# Altium project MainBoard.PrjPcb (part 2 of 3)

## Sheet HMI.SchDoc: Témoins et boutons
size Letter; Organization: Robocup Ulaval; DocumentNumber: 7; Revision: 1.0; SheetNumber: 7; SheetTotal: 10; Version: Gamma 1.0; Conceptor: Philippe T. Simon B. Léonard G. Alexia B-L.
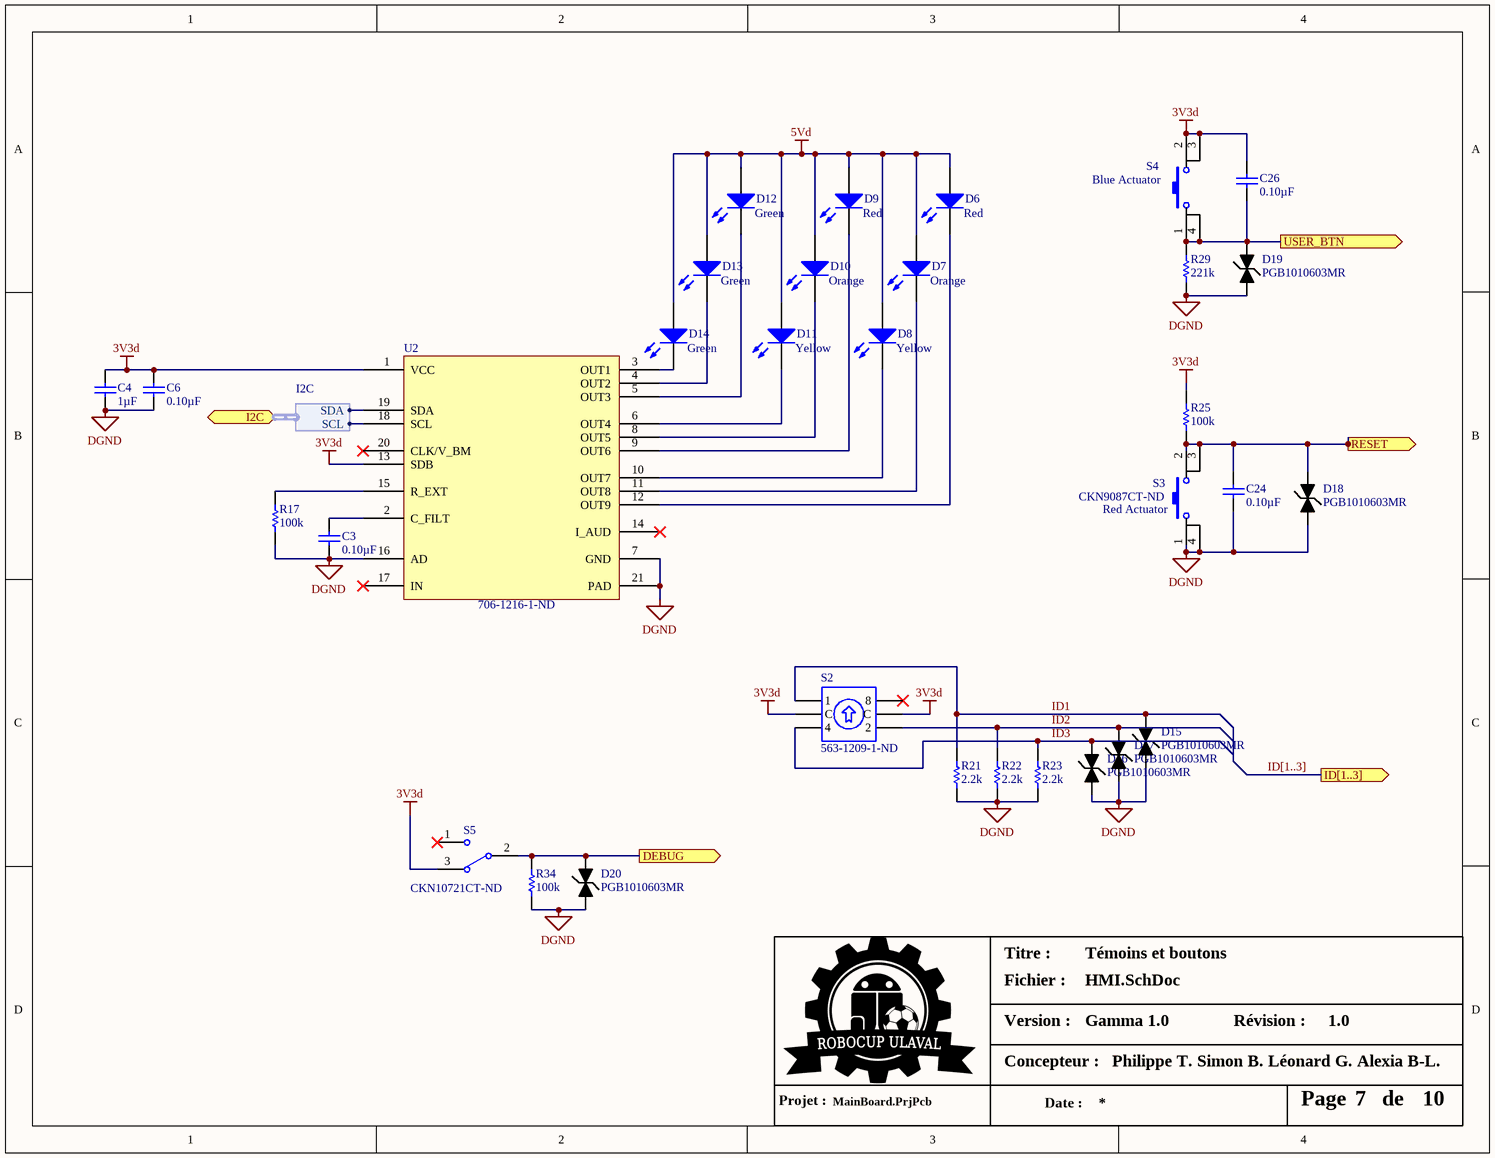
[diagram p5: HMI.SchDoc]

### Parts
C3  Capacitance: 0.10µF  [0603]  (hidden comment: CL10B104KB8SFNC)
C4  Capacitance: 1µF  [0805]  (hidden comment: CL21B105KBFNFNE)
C6  Capacitance: 0.10µF  [0603]  (hidden comment: CL10B104KB8SFNC)
C24  Capacitance: 0.10µF  [0603]  (hidden comment: CL10B104KB8SFNC)
C26  Capacitance: 0.10µF  [0603]  (hidden comment: CL10B104KB8SFNC)
D6  Color: Red  [0805]  (hidden comment: LH R974-LP-1)
D7  Color: Orange  [0805]  (hidden comment: AA1112H-TR)
D8  Color: Yellow  [0805]  (hidden comment: LY R976-PS-36)
D9  Color: Red  [0805]  (hidden comment: LH R974-LP-1)
D10  Color: Orange  [0805]  (hidden comment: AA1112H-TR)
D11  Color: Yellow  [0805]  (hidden comment: LY R976-PS-36)
D12  Color: Green  [0805]  (hidden comment: LG R971-KN-1)
D13  Color: Green  [0805]  (hidden comment: LG R971-KN-1)
D14  Color: Green  [0805]  (hidden comment: LG R971-KN-1)
D15  PGB1010603MR  [0603]
D16  PGB1010603MR  [0603]
D17  PGB1010603MR  [0603]
D18  PGB1010603MR  [0603]
D19  PGB1010603MR  [0603]
D20  PGB1010603MR  [0603]
R17  Resistance (Ohms): 100k  [0603]  (hidden comment: RC0603JR-07100KL)
R21  Resistance (Ohms): 2.2k  [0603]  (hidden comment: RC0603FR-072K2L)
R22  Resistance (Ohms): 2.2k  [0603]  (hidden comment: RC0603FR-072K2L)
R23  Resistance (Ohms): 2.2k  [0603]  (hidden comment: RC0603FR-072K2L)
R25  Resistance (Ohms): 100k  [0603]  (hidden comment: RC0603JR-07100KL)
R29  Resistance (Ohms): 221k  [0603]  (hidden comment: RC0603FR-07221KL)
R34  Resistance (Ohms): 100k  [0603]  (hidden comment: RC0603JR-07100KL)
S2  Supplier Part Number 1: 563-1209-1-ND  [RotarySwitch]  (hidden comment: SH-7010TB)
S3  Supplier Part Number 1: CKN9087CT-ND  Features: Red Actuator  [6 mm Tact Switches]  (hidden comment: PTS645SK50SMTR92 LFS)
S4  Features: Blue Actuator  [6 mm Tact Switches]  (hidden comment: PTS645SM43SMTR92 LFS)
S5  Supplier Part Number 1: CKN10721CT-ND  [SPDT-SW]  (hidden comment: JS102011JCQN)
U2  Supplier Part Number 1: 706-1216-1-ND  [QFN40P300X300X80_HS-21N]  (hidden comment: IS31FL3199-QFLS2-TR)

### Ports
DEBUG (out), I2C (harness I2C), ID[1..3] (out), RESET (out), USER_BTN (out)

### Harnesses
I2C: SCL, SDA

### Nets
3V3d: C4.2 C6.2 C26.2 R25.2 S2.2(C) S2.5(C) S4.2 S4.3 S5.3 U2.1(VCC) U2.13(SDB)
5Vd: D6.1(A) D7.1(A) D8.1(A) D9.1(A) D10.1(A) D11.1(A) D12.1(A) D13.1(A) D14.1(A)
DGND: C3.1 C4.1 C6.1 C24.1 D15.1 D16.1 D17.1 D18.1 D19.1 D20.1 R17.1 R21.1 R22.1 R23.1 R29.1 R34.1 S3.1 S3.4 U2.7(GND) U2.16(AD) U2.21(PAD)
DEBUG: D20.2 R34.2 S5.2 ; port DEBUG
ID1: D15.2 R21.2 S2.1
ID2: D17.2 R22.2 S2.4(2)
ID3: D16.2 R23.2 S2.3(4)
RESET: C24.2 D18.2 R25.1 S3.2 S3.3 ; port RESET
SCL: U2.18(SCL) ; port I2C.SCL
SDA: U2.19(SDA) ; port I2C.SDA
USER_BTN: C26.1 D19.2 R29.2 S4.1 S4.4 ; port USER_BTN
NetC3_2: C3.2 U2.2(C_FILT)
NetD6_2: D6.2(K) U2.12(OUT9)
NetD7_2: D7.2(K) U2.11(OUT8)
NetD8_2: D8.2(K) U2.10(OUT7)
NetD9_2: D9.2(K) U2.9(OUT6)
NetD10_2: D10.2(K) U2.8(OUT5)
NetD11_2: D11.2(K) U2.6(OUT4)
NetD12_2: D12.2(K) U2.5(OUT3)
NetD13_2: D13.2(K) U2.4(OUT2)
NetD14_2: D14.2(K) U2.3(OUT1)
NetR17_2: R17.2 U2.15(R_EXT)

Not connected (* = marked no-connect by the designer): S2 6(8)*; S5 1*; U2 14(I_AUD)* 17(IN)* 20(CLK/V_BM)*

### Buses and harness runs
bus ID[1..3] = port ID[1..3]

### Notes on the sheet
- Titre :
- Version :
- Fichier :
- Révision :
- Projet :
- Concepteur :
- Date :
- Page
- de

### Library data of the parts
C3 C6 C24 C26 = CL10B104KB8SFNC: CAP CER 0.1UF 50V X7R 0603; Manufacturer: Samsung Electro-Mechanics America, Inc.; Tolerance: ±10%; Supplier 1: Digi-Key; Manufacturer Part Number: CL10B104KB8SFNC; RoHS: RoHS Compliant; Category: Capacitors; Packaging: Cut Tape (CT); Voltage - Rated: 50V; Temperature Coefficient: X7R; Mounting Type: Surface Mount, MLCC; Operating Temperature: -55°C ~ 125°C; Applications: Boardflex Sensitive; Ratings: -; Package / Case: 0603 (1608 Metric); Size / Dimension: 0.063" L x 0.031" W (1.60mm x 0.80mm); Height - Seated (Max): -; Thickness (Max): 0.035" (0.90mm); Lead Spacing: -; Features: Soft Termination; Lead Style: -; ComponentLink1URL: http://www.samsungsem.com/kr/support/product-search/mlcc/CL10B104KB8SFNC.jsp; ComponentLink1Description: http://www.samsungsem.com/kr/support/product-search/mlcc/CL10B104KB8SFNC.jsp; Supplier Part Number 1: 445-173846-1-ND
C4 = CL21B105KBFNFNE: CAP CER 1UF 50V X7R 0805; Manufacturer: Samsung Electro-Mechanics America, Inc.; Tolerance: ±10%; Supplier 1: Digi-Key; Manufacturer Part Number: CL21B105KBFNFNE; RoHS: RoHS Compliant; Stock 1: 21699; Pricing 1: 1=0.27, 10=0.186, 25=0.14, 50=0.1072, 100=0.0884, 500=0.06238, 1000=0.05123 (CAD); Packaging: Cut Tape (CT); Voltage - Rated: 50V; Temperature Coefficient: X7R; Mounting Type: Surface Mount, MLCC; Operating Temperature: -55°C ~ 125°C; Applications: General Purpose; Ratings: -; Package / Case: 0805 (2012 Metric); Size / Dimension: 0.079" L x 0.049" W (2.00mm x 1.25mm); Height - Seated (Max): -; Thickness (Max): 0.053" (1.35mm); Lead Spacing: -; Features: -; Lead Style: -; ComponentLink1URL: http://www.samsungsem.com/kr/support/product-search/mlcc/CL21B105KBFNFNE.jsp; ComponentLink1Description: http://www.samsungsem.com/kr/support/product-search/mlcc/CL21B105KBFNFNE.jsp; Supplier Part Number 1: 1276-2928-1-ND; Category: Capacitors
D6 D9 = LH R974-LP-1: LED RED DIFFUSED 0805 SMD; Manufacturer: OSRAM Opto Semiconductors Inc.; Lens Color: White; Millicandela Rating: 41mcd; Lens Style/Size: Rectangle with Flat Top, 1.30mm x 1.25mm; Voltage - Forward (Vf) (Typ): 1.8V; Current - Test: 20mA; Viewing Angle: 160°; Wavelength - Dominant: 645nm; Wavelength - Peak: 660nm; Supplier 1: Digi-Key; Manufacturer Part Number: LH R974-LP-1; RoHS: RoHS Compliant; Category: Optoelectronics; Stock 1: 124060; Pricing 1: 1=0.37, 10=0.267, 25=0.1972, 100=0.141, 250=0.09588, 500=0.0846, 1000=0.06626 (CAD); Packaging: Cut Tape (CT); Lens Transparency: Diffused; Mounting Type: Surface Mount; Features: -; Package / Case: 0805 (2012 Metric); Supplier Device Package: *; Size / Dimension: 2.00mm L x 1.25mm W; Height (Max): 0.90mm; ComponentLink1URL: http://www.osram-os.com/Graphics/XPic8/00078869_0.pdf; ComponentLink1Description: http://www.osram-os.com/Graphics/XPic8/00078869_0.pdf; Supplier Part Number 1: 475-1415-1-ND
D7 D10 = AA1112H-TR: LED ORANGE DIFFUSED 0805 SMD; Manufacturer: Stanley Electric Co; Lens Color: White; Millicandela Rating: 3.7mcd; Lens Style/Size: Rectangle with Flat Top, 1.20mm x 1.25mm; Voltage - Forward (Vf) (Typ): 2.2V; Current - Test: 20mA; Viewing Angle: 153°, 154°; Wavelength - Dominant: 606nm; Wavelength - Peak: 605nm; Supplier 1: Digi-Key; Manufacturer Part Number: AA1112H-TR; RoHS: RoHS Compliant; Category: Optoelectronics; Stock 1: 7828; Pricing 1: 1=0.65, 10=0.458, 25=0.3752, 100=0.3003, 250=0.2252, 1000=0.16379 (CAD); Packaging: Cut Tape (CT); Lens Transparency: Diffused; Mounting Type: Surface Mount; Features: -; Package / Case: 0805 (2012 Metric); Supplier Device Package: 2125; Size / Dimension: 2.00mm L x 1.25mm W; Height (Max): 0.90mm; ComponentLink1URL: http://media.digikey.com/pdf/Data%20Sheets/Stanley%20Electric%20PDFs/BR1112H.pdf; ComponentLink1Description: http://media.digikey.com/pdf/Data%20Sheets/Stanley%20Electric%20PDFs/BR1112H.pdf; Supplier Part Number 1: 404-1018-1-ND
D8 D11 = LY R976-PS-36: LED YELLOW DIFFUSED 0805 SMD; Manufacturer: OSRAM Opto Semiconductors Inc.; Lens Color: White; Millicandela Rating: 162.5mcd; Lens Style/Size: Rectangle with Flat Top, 1.30mm x 1.25mm; Voltage - Forward (Vf) (Typ): 2V; Current - Test: 20mA; Viewing Angle: 160°; Wavelength - Dominant: 588nm; Wavelength - Peak: 591nm; Supplier 1: Digi-Key; Manufacturer Part Number: LY R976-PS-36; RoHS: RoHS Compliant; Category: Optoelectronics; Stock 1: 102790; Pricing 1: 1=0.38, 10=0.282, 25=0.2076, 100=0.1484, 250=0.10088, 500=0.08904, 1000=0.06974 (CAD); Packaging: Cut Tape (CT); Lens Transparency: Diffused; Mounting Type: Surface Mount; Features: -; Package / Case: 0805 (2012 Metric); Supplier Device Package: 0805; Size / Dimension: 2.00mm L x 1.25mm W; Height (Max): 0.90mm; ComponentLink1URL: http://www.osram-os.com/Graphics/XPic9/00078941_0.pdf; ComponentLink1Description: http://www.osram-os.com/Graphics/XPic9/00078941_0.pdf; Supplier Part Number 1: 475-2560-1-ND
D12-D14 = LG R971-KN-1: LED GREEN DIFFUSED 0805 SMD; Manufacturer: OSRAM Opto Semiconductors Inc.; Lens Color: White; Millicandela Rating: 26.05mcd; Lens Style/Size: Rectangle with Flat Top, 1.30mm x 1.25mm; Voltage - Forward (Vf) (Typ): 2.2V; Current - Test: 20mA; Viewing Angle: 160°; Wavelength - Dominant: 570nm; Wavelength - Peak: 572nm; Supplier 1: Digi-Key; Manufacturer Part Number: LG R971-KN-1; RoHS: RoHS Compliant; Category: Optoelectronics; Stock 1: 315869; Pricing 1: 1=0.37, 10=0.267, 25=0.1972, 100=0.141, 250=0.09588, 500=0.0846, 1000=0.06626 (CAD); Packaging: Cut Tape (CT); Lens Transparency: Diffused; Mounting Type: Surface Mount; Features: -; Package / Case: 0805 (2012 Metric); Supplier Device Package: *; Size / Dimension: 2.00mm L x 1.25mm W; Height (Max): 0.90mm; ComponentLink1URL: http://www.osram-os.com/Graphics/XPic9/00078860_0.pdf; ComponentLink1Description: http://www.osram-os.com/Graphics/XPic9/00078860_0.pdf; Supplier Part Number 1: 475-1410-1-ND
D15-D20 = PGB1010603MR: TVS DIODE 24VWM 150VC 0603; Supplier 1: Digi-Key; Supplier Part Number 1: F2594TR-ND
R17 R25 R34 = RC0603JR-07100KL: RES SMD 100K OHM 5% 1/10W 0603; Manufacturer: Yageo; Power (Watts): 0.1W, 1/10W; Temperature Coefficient: ±100ppm/°C; Supplier 1: Digi-Key; Manufacturer Part Number: RC0603JR-07100KL; RoHS: RoHS Compliant; Category: Resistors; Stock 1: 2803334; Pricing 1: 1=0.15, 10=0.017, 25=0.012, 100=0.0067, 250=0.00508, 500=0.00408, 1000=0.003, 2500=0.0026 (CAD); Packaging: Cut Tape (CT); Tolerance: ±5%; Composition: Thick Film; Features: Moisture Resistant; Operating Temperature: -55°C ~ 155°C; Package / Case: 0603 (1608 Metric); Supplier Device Package: 0603; Size / Dimension: 0.063" L x 0.031" W (1.60mm x 0.80mm); Height: 0.022" (0.55mm); Number of Terminations: 2; ComponentLink1URL: http://www.yageo.com/documents/recent/PYu-RC_Group_51_RoHS_L_04.pdf; ComponentLink1Description: http://www.yageo.com/documents/recent/PYu-RC_Group_51_RoHS_L_04.pdf; Supplier Part Number 1: 311-100KGRCT-ND
R21-R23 = RC0603FR-072K2L: RES SMD 2.2K OHM 1% 1/10W 0603; Manufacturer: Yageo; Power (Watts): 0.1W, 1/10W; Temperature Coefficient: ±100ppm/°C; Supplier 1: Digi-Key; Manufacturer Part Number: RC0603FR-072K2L; RoHS: RoHS Compliant; Category: Resistors; Stock 1: 297758; Pricing 1: 1=0.15, 10=0.021, 25=0.0152, 100=0.0086, 250=0.0066, 500=0.00526, 1000=0.00389, 2500=0.00337 (CAD); Packaging: Cut Tape (CT); Tolerance: ±1%; Composition: Thick Film; Features: Moisture Resistant; Operating Temperature: -55°C ~ 155°C; Package / Case: 0603 (1608 Metric); Supplier Device Package: 0603; Size / Dimension: 0.063" L x 0.031" W (1.60mm x 0.80mm); Height: 0.022" (0.55mm); Number of Terminations: 2; ComponentLink1URL: http://www.yageo.com/documents/recent/PYu-RC_Group_51_RoHS_L_04.pdf; ComponentLink1Description: http://www.yageo.com/documents/recent/PYu-RC_Group_51_RoHS_L_04.pdf; Supplier Part Number 1: 311-2.20KHRCT-ND
R29 = RC0603FR-07221KL: RES SMD 221K OHM 1% 1/10W 0603; Manufacturer: Yageo; Power (Watts): 0.1W, 1/10W; Temperature Coefficient: ±100ppm/°C; Supplier 1: Digi-Key; Manufacturer Part Number: RC0603FR-07221KL; RoHS: RoHS Compliant; Category: Resistors; Stock 1: 288409; Pricing 1: 1=0.15, 10=0.021, 25=0.0152, 100=0.0086, 250=0.0066, 500=0.00526, 1000=0.00389, 2500=0.00337 (CAD); Packaging: Cut Tape (CT); Tolerance: ±1%; Composition: Thick Film; Features: Moisture Resistant; Operating Temperature: -55°C ~ 155°C; Package / Case: 0603 (1608 Metric); Supplier Device Package: 0603; Size / Dimension: 0.063" L x 0.031" W (1.60mm x 0.80mm); Height: 0.022" (0.55mm); Number of Terminations: 2; ComponentLink1URL: http://www.yageo.com/documents/recent/PYu-RC_Group_51_RoHS_L_04.pdf; ComponentLink1Description: http://www.yageo.com/documents/recent/PYu-RC_Group_51_RoHS_L_04.pdf; Supplier Part Number 1: 311-221KHRCT-ND
S2 = SH-7010TB: SWITCH ROTARY DIP BCD 100MA 5V; Manufacturer: Copal Electronics Inc.; Number of Positions: 10; Voltage Rating: 5VDC; Actuator Type: Rotary for Tool; Actuator Level: Flush, Recessed; Pitch: 0.100" (2.54mm), Full; Washable: Yes; Body Material: Polyphenylene Sulfide (PPS); Electrical Life: 10,000 Steps; Supplier 1: Digi-Key; Manufacturer Part Number: SH-7010TB; RoHS: RoHS Compliant; Category: Switches; Stock 1: 18527; Pricing 1: 1=2.91, 10=2.798, 25=2.554, 50=2.4326, 100=2.1893, 250=2.00688 (CAD); Packaging: Cut Tape (CT); Circuit: BCD; Current Rating: 100mA; Contact Material: Copper Alloy; Contact Finish: Gold; Height Above Board: 0.148" (3.75mm); Mounting Type: Surface Mount; Termination Style: Gull Wing; Features: -; Length: 0.287" (7.30mm); Operating Temperature: -40°C ~ 85°C; Mechanical Life: -; ComponentLink1URL: http://www.nidec-copal-electronics.com/e/catalog/switch/sh-7000.pdf; ComponentLink1Description: http://www.nidec-copal-electronics.com/e/catalog/switch/sh-7000.pdf
S3 = PTS645SK50SMTR92 LFS: SWITCH TACTILE SPST-NO 0.05A 12V; Manufacturer: C&K Components; Switch Function: Off-Mom; Contact Rating @ Voltage: 0.05A @ 12VDC; Actuator Type: Standard; Actuator Height off PCB, from Pins: 5.00mm; Actuator Orientation: Top Actuated; Outline: 6.00mm x 6.00mm; Illumination: Non-Illuminated; Operating Force: 260gf; Actuator Material: Polyamide (PA66), Nylon 6/6; Mechanical Life: 100,000 Cycles; Supplier 1: Digi-Key; Manufacturer Part Number: PTS645SK50SMTR92 LFS; RoHS: RoHS Compliant; Category: Switches; Stock 1: 73782; Pricing 1: 1=0.38, 10=0.362, 25=0.35, 50=0.3374, 100=0.3186, 250=0.29976, 500=0.2873 (CAD); Packaging: Cut Tape (CT); Circuit: SPST-NO; Mounting Type: Surface Mount; Termination Style: Gull Wing; Illumination Voltage (Nominal): -; Illumination Type, Color: -; Ingress Protection: -; Switch Travel: -; Operating Temperature: -20°C ~ 60°C; ComponentLink1URL: http://media.digikey.com/pdf/Data%20Sheets/C&K/PTS645_Series.pdf; ComponentLink1Description: http://media.digikey.com/pdf/Data%20Sheets/C&K/PTS645_Series.pdf
S4 = PTS645SM43SMTR92 LFS: SWITCH TACTILE SPST-NO 0.05A 12V; Manufacturer: C&K Components; Switch Function: Off-Mom; Contact Rating @ Voltage: 0.05A @ 12VDC; Actuator Type: Standard; Actuator Height off PCB, from Pins: 4.30mm; Actuator Orientation: Top Actuated; Outline: 6.00mm x 6.00mm; Illumination: Non-Illuminated; Operating Force: 160gf; Actuator Material: Polyamide (PA66), Nylon 6/6; Mechanical Life: 100,000 Cycles; Supplier 1: Digi-Key; Supplier Part Number 1: CKN9112CT-ND; Manufacturer Part Number: PTS645SM43SMTR92 LFS; RoHS: RoHS Compliant; Category: Switches; Stock 1: 189506; Pricing 1: 1=0.44, 10=0.425, 25=0.4108, 50=0.3958, 100=0.3737, 250=0.35176, 500=0.33708 (CAD); Packaging: Cut Tape (CT); Circuit: SPST-NO; Mounting Type: Surface Mount; Termination Style: Gull Wing; Illumination Voltage (Nominal): -; Illumination Type, Color: -; Ingress Protection: -; Switch Travel: -; Operating Temperature: -20°C ~ 60°C; ComponentLink1URL: http://media.digikey.com/pdf/Data%20Sheets/C&K/PTS645_Series.pdf; ComponentLink1Description: http://media.digikey.com/pdf/Data%20Sheets/C&K/PTS645_Series.pdf
S5 = JS102011JCQN: SWITCH SLIDE SPDT 300MA 6V; Manufacturer: C&K Components; Contact Timing: Not Specified; Switch Function: On-On; Current Rating: 300mA (DC); Actuator Type: Standard; Actuator Length: 2.00mm; Actuator Material: Polyamide (PA46), Nylon 4/6; Electrical Life: 5,000 Cycles; Supplier 1: Digi-Key; Manufacturer Part Number: JS102011JCQN; RoHS: RoHS Compliant; Category: Switches; Stock 1: 1803; Pricing 1: 1=0.9, 10=0.873, 25=0.8544, 50=0.7636, 100=0.7272, 250=0.70896, 500=0.59992 (CAD); Packaging: Cut Tape (CT); Part Status: Active; Circuit: SPDT; Voltage Rating - AC: -; Voltage Rating - DC: 6V; Contact Material: Copper Alloy; Contact Finish: Silver; Mounting Type: Surface Mount; Termination Style: J Lead; Features: -; Switch Travel: 2.00mm; Operating Temperature: -40°C ~ 85°C; Mechanical Life: -; Operating Force: -; ComponentLink1URL: http://www.ck-components.com/media/1422/js.pdf; ComponentLink1Description: http://www.ck-components.com/media/1422/js.pdf
U2 = IS31FL3199-QFLS2-TR: IC LED DRIVER LIN DIM 40MA 20QFN; Manufacturer: ISSI, Integrated Silicon Solution Inc; Internal Switch(s): Yes; Number of Outputs: 9; Voltage - Supply (Min): 2.7V; Voltage - Supply (Max): 5.5V; Dimming: PWM; Supplier 1: Digi-Key; Manufacturer Part Number: IS31FL3199-QFLS2-TR; RoHS: RoHS Compliant; Category: Integrated Circuits (ICs); Stock 1: 2174; Pricing 1: 1=2.4, 10=2.134, 25=1.9272, 100=1.6863, 250=1.4798, 500=1.30778, 1000=1.03244 (CAD); Packaging: Cut Tape (CT); Type: Linear; Topology: -; Voltage - Output: -; Current - Output / Channel: 40mA; Frequency: -; Applications: -; Operating Temperature: -40°C ~ 85°C (TA); Mounting Type: Surface Mount; Package / Case: 20-VFQFN Exposed Pad; Supplier Device Package: 20-QFN (3x3); ComponentLink1URL: http://www.issi.com/WW/pdf/31FL3199.pdf; ComponentLink1Description: http://www.issi.com/WW/pdf/31FL3199.pdf

## Sheet IMU.SchDoc: Capteur inertiel
size Letter; Organization: Robocup Ulaval; DocumentNumber: 6; Revision: 1.0; SheetNumber: 6; SheetTotal: 10; Version: Gamma 1.0; Conceptor: Philippe T. Simon B. Léonard G. Alexia B-L.
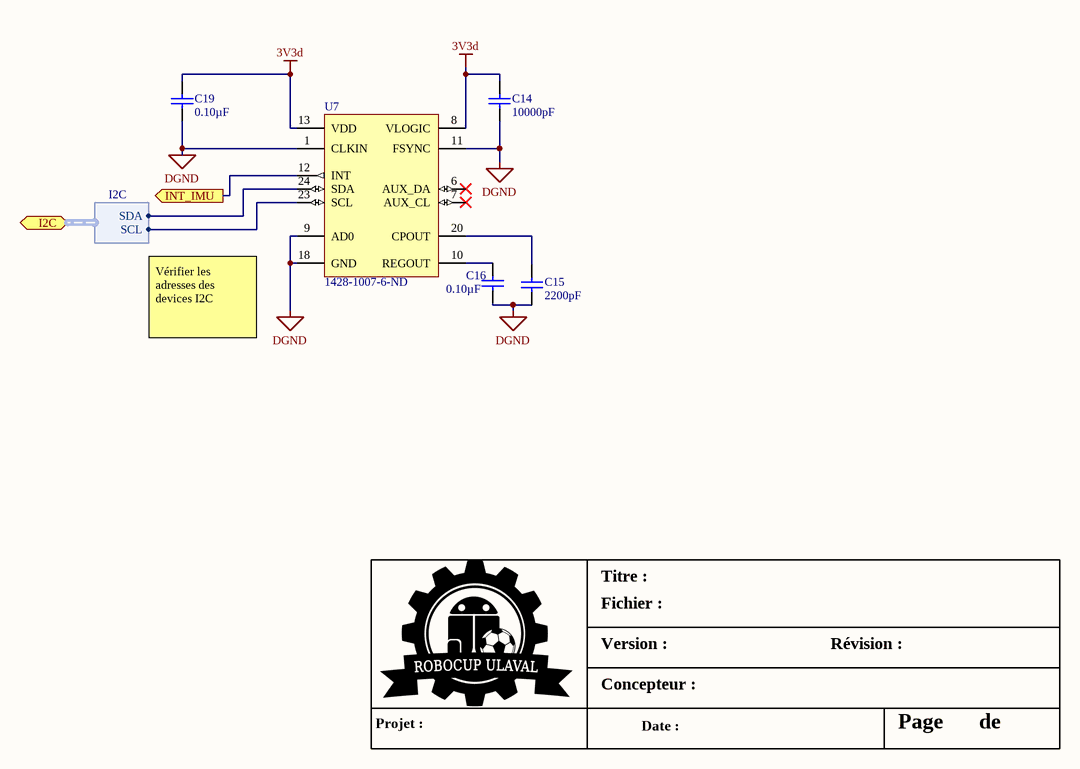
[diagram p6: IMU.SchDoc]

### Parts
C14  Capacitance: 10000pF  [0603]  (hidden comment: GRM188R71H103KA01D)
C15  Capacitance: 2200pF  [0603]  (hidden comment: CL10B222KB8SFNC)
C16  Capacitance: 0.10µF  [0603]  (hidden comment: CL10B104KB8SFNC)
C19  Capacitance: 0.10µF  [0603]  (hidden comment: CL10B104KB8SFNC)
U7  Supplier Part Number 1: 1428-1007-6-ND  [VQFN-24]  (hidden comment: MPU-6050)

### Ports
I2C (harness I2C), INT_IMU (out)

### Harnesses
I2C: SCL, SDA

### Nets
3V3d: C14.2 C19.2 U7.8(VLOGIC) U7.13(VDD)
DGND: C14.1 C15.1 C16.1 C19.1 U7.1(CLKIN) U7.9(AD0) U7.11(FSYNC) U7.18(GND)
IMU_IRQ: U7.12(INT) ; port INT_IMU
SCL: U7.23(SCL) ; port I2C.SCL
SDA: U7.24(SDA) ; port I2C.SDA
NetC15_2: C15.2 U7.20(CPOUT)
NetC16_2: C16.2 U7.10(REGOUT)

Not connected (* = marked no-connect by the designer): U7 6(AUX_DA)* 7(AUX_CL)*

### Notes on the sheet
- Vérifier les adresses des devices I2C
- Titre :
- Version :
- Fichier :
- Révision :
- Projet :
- Concepteur :
- Date :
- Page
- de

### Library data of the parts
C14 = GRM188R71H103KA01D: CAP CER 10000PF 50V X7R 0603; Manufacturer: Murata Electronics North America; Tolerance: ±10%; Supplier 1: Digi-Key; Manufacturer Part Number: GRM188R71H103KA01D; RoHS: RoHS Compliant; Category: Capacitors; Stock 1: 3064909; Pricing 1: 1=0.14, 10=0.027, 50=0.0142, 100=0.0121, 250=0.00988, 500=0.00848, 1000=0.00661 (CAD); Packaging: Cut Tape (CT); Voltage - Rated: 50V; Temperature Coefficient: X7R; Mounting Type: Surface Mount, MLCC; Operating Temperature: -55°C ~ 125°C; Applications: General Purpose; Ratings: -; Package / Case: 0603 (1608 Metric); Size / Dimension: 0.063" L x 0.031" W (1.60mm x 0.80mm); Height - Seated (Max): -; Thickness (Max): 0.035" (0.90mm); Lead Spacing: -; Features: -; Lead Style: -; ComponentLink1URL: http://www.murata.com/~/media/webrenewal/support/library/catalog/products/capacitor/mlcc/c02e.pdf; ComponentLink1Description: http://www.murata.com/~/media/webrenewal/support/library/catalog/products/capacitor/mlcc/c02e.pdf; Supplier Part Number 1: 490-1512-1-ND
C15 = CL10B222KB8SFNC: CAP CER 2200PF 50V X7R 0603; Manufacturer: Samsung Electro-Mechanics America, Inc.; Tolerance: ±10%; Supplier 1: Digi-Key; Manufacturer Part Number: CL10B222KB8SFNC; RoHS: RoHS Compliant; Category: Capacitors; Stock 1: 52876; Pricing 1: 1=0.14, 10=0.041, 25=0.0292, 50=0.0222, 100=0.0188, 500=0.01314, 1000=0.01024 (CAD); Packaging: Cut Tape (CT); Voltage - Rated: 50V; Temperature Coefficient: X7R; Mounting Type: Surface Mount, MLCC; Operating Temperature: -55°C ~ 125°C; Applications: Boardflex Sensitive; Ratings: -; Package / Case: 0603 (1608 Metric); Size / Dimension: 0.063" L x 0.031" W (1.60mm x 0.80mm); Height - Seated (Max): -; Thickness (Max): 0.035" (0.90mm); Lead Spacing: -; Features: Soft Termination; Lead Style: -; ComponentLink1URL: http://www.samsungsem.com/kr/support/product-search/mlcc/CL10B222KB8SFNC.jsp; ComponentLink1Description: http://www.samsungsem.com/kr/support/product-search/mlcc/CL10B222KB8SFNC.jsp; Supplier Part Number 1: 1276-1992-1-ND
C16 C19 = CL10B104KB8SFNC: as C3 on sheet HMI; Supplier 1: Digi-Key; Manufacturer Part Number: CL10B104KB8SFNC; RoHS: RoHS Compliant; Category: Capacitors; Packaging: Cut Tape (CT); Voltage - Rated: 50V; Temperature Coefficient: X7R; Mounting Type: Surface Mount, MLCC; Operating Temperature: -55°C ~ 125°C; Applications: Boardflex Sensitive; Ratings: -; Package / Case: 0603 (1608 Metric); Size / Dimension: 0.063" L x 0.031" W (1.60mm x 0.80mm); Height - Seated (Max): -; Thickness (Max): 0.035" (0.90mm); Lead Spacing: -; Features: Soft Termination; Lead Style: -; ComponentLink1URL: http://www.samsungsem.com/kr/support/product-search/mlcc/CL10B104KB8SFNC.jsp; ComponentLink1Description: http://www.samsungsem.com/kr/support/product-search/mlcc/CL10B104KB8SFNC.jsp; Supplier Part Number 1: 445-173846-1-ND
U7 = MPU-6050: GYRO/ACCELEROMETER 6AXIS 24QFN; Manufacturer: InvenSense; Sensor Type: Accelerometer, Gyroscope, 3 Axis; Output Type: I²C; Supplier 1: Digi-Key; Manufacturer Part Number: MPU-6050; RoHS: RoHS Compliant; Category: Sensors, Transducers; Stock 1: 15335; Pricing 1: 1=11.73, 5=10.282, 10=9.254, 25=8.2264, 50=7.6094, 100=6.5812, 500=6.1699, 1000=5.75857 (CAD); Operating Temperature: -40°C ~ 85°C (TA); ComponentLink1URL: http://store.invensense.com/datasheets/invensense/MPU-6050_DataSheet_V3%204.pdf; ComponentLink1Description: http://store.invensense.com/datasheets/invensense/MPU-6050_DataSheet_V3%204.pdf

## Sheet RFModule.SchDoc: RF module - Communication
size A4; Organization: Robocup Ulaval; DocumentNumber: 5; Revision: 1.0; SheetNumber: 5; SheetTotal: 10; Version: Gamma 1.0; Conceptor: Philippe T. Simon B. Léonard G. Alexia B-L.
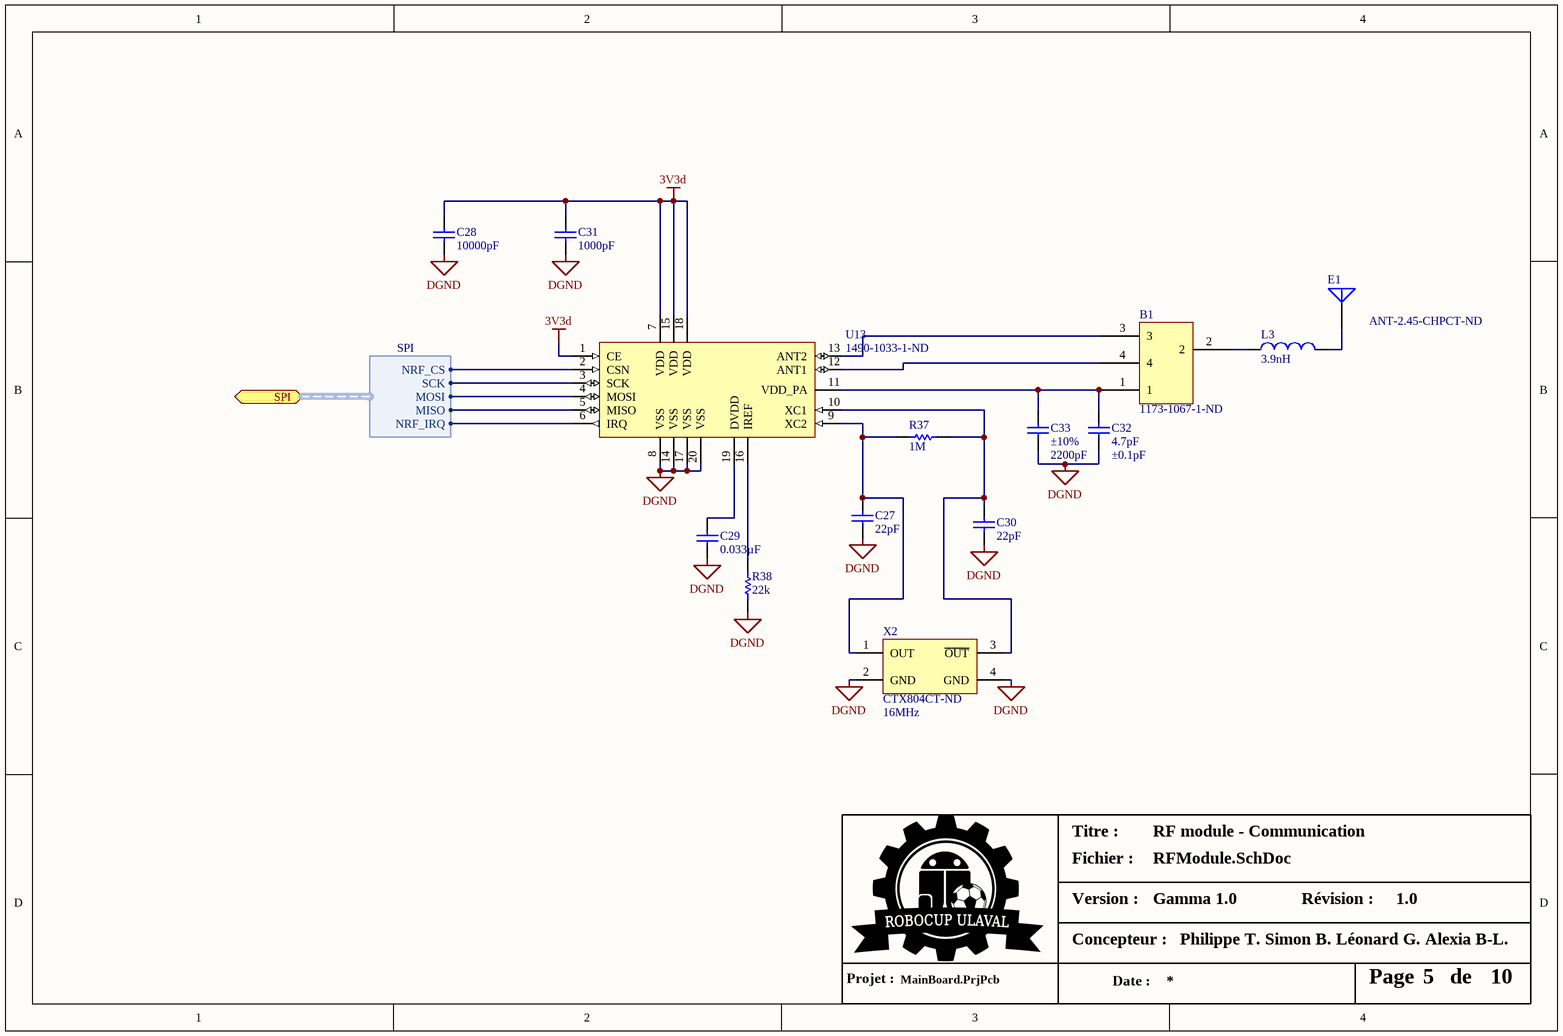
[diagram p7: RFModule.SchDoc]

### Parts
B1  Supplier Part Number 1: 1173-1067-1-ND  [BD2425NNRF]  (hidden comment: BD2425NNRF)
C27  Capacitance: 22pF  [0603]  (hidden comment: CL10C220GB8NNNC)
C28  Capacitance: 10000pF  [0603]  (hidden comment: GRM188R71H103KA01D)
C29  Capacitance: 0.033µF  [0603]  (hidden comment: CL10B333KB8SFNC)
C30  Capacitance: 22pF  [0603]  (hidden comment: CL10C220GB8NNNC)
C31  Capacitance: 1000pF  [0603]  (hidden comment: CL10B102KB8NNNC)
C32  Capacitance: 4.7pF  Tolerance: ±0.1pF  [0402]  (hidden comment: GRM1555C1E4R7BA01D)
C33  Tolerance: ±10%  Capacitance: 2200pF  [0402]  (hidden comment: GRM155R61A222KA01D)
E1  Supplier Part Number 1: ANT-2.45-CHPCT-ND  [ANT-2.45-CHP-x]  (hidden comment: ANT-2.45-CHP-T)
L3  Inductance: 3.9nH  [0402]  (hidden comment: LQP15MN3N9B02D)
R37  Resistance (Ohms): 1M  [0603]  (hidden comment: RC0603FR-071ML)
R38  Resistance (Ohms): 22k  [0603]  (hidden comment: RC0603FR-0722KL)
U13  Supplier Part Number 1: 1490-1033-1-ND  [QFN40P300X300X80_HS-21N]  (hidden comment: NRF24L01P-R7)
X2  Supplier Part Number 1: CTX804CT-ND  Frequency: 16MHz  [QFN138P200X250X65-4N]  (hidden comment: 425F35B016M0000)

### Ports
SPI (harness SPI)

### Harnesses
SPI: MISO, MOSI, NRF_CS, NRF_IRQ, SCK

### Nets
3V3d: C28.2 C31.2 U13.1(CE) U13.7(VDD) U13.15(VDD) U13.18(VDD)
DGND: C27.1 C28.1 C29.1 C30.1 C31.1 C32.1 C33.1 R38.1 U13.8(VSS) U13.14(VSS) U13.17(VSS) U13.20(VSS) X2.2(GND) X2.4(GND)
MISO: U13.5(MISO) ; port SPI.MISO
MOSI: U13.4(MOSI) ; port SPI.MOSI
NRF_CS: U13.2(CSN) ; port SPI.NRF_CS
NRF_IRQ: U13.6(IRQ) ; port SPI.NRF_IRQ
SCK: U13.3(SCK) ; port SPI.SCK
NetB1_1: B1.1 C32.2 C33.2 U13.11(VDD_PA)
NetB1_2: B1.2 L3.1
NetB1_3: B1.3 U13.13(ANT2)
NetB1_4: B1.4 U13.12(ANT1)
NetC27_2: C27.2 R37.1 U13.9(XC2) X2.1(OUT)
NetC29_2: C29.2 U13.19(DVDD)
NetC30_2: C30.2 R37.2 U13.10(XC1) X2.3(~{OUT})
NetE1_1: E1.1(A) L3.2
NetR38_2: R38.2 U13.16(IREF)

### Notes on the sheet
- Titre :
- Version :
- Fichier :
- Révision :
- Projet :
- Concepteur :
- Date :
- Page
- de

### Library data of the parts
B1 = BD2425NNRF: XFRMR BALUN RF 2400-2500MHZ 0404; Manufacturer: Anaren; Frequency Range: 2.4GHz ~ 2.525GHz; Impedance - Unbalanced/Balanced: 50 / - Ohm; Insertion Loss (Max): 1.25dB; Return Loss (Min): 18dB; Supplier 1: Digi-Key; Manufacturer Part Number: BD2425NNRF; RoHS: RoHS Compliant; Category: RF/IF and RFID; Stock 1: 7728; Pricing 1: 1=0.86, 10=0.838, 25=0.5604, 50=0.4992, 100=0.4572, 250=0.4102, 500=0.40166 (CAD); Packaging: Cut Tape (CT); Part Status: Active; Phase Difference: -; Package / Case: 0404 (1010 Metric); Mounting Type: Surface Mount; ComponentLink1URL: https://www.anaren.com/sites/default/files/BD2425NnRF%20Data%20Sheet%20Rev%20B_Final.pdf; ComponentLink1Description: https://www.anaren.com/sites/default/files/BD2425NnRF%20Data%20Sheet%20Rev%20B_Final.pdf
C27 C30 = CL10C220GB8NNNC: CAP CER 22PF 50V NP0 0603; Manufacturer: Samsung Electro-Mechanics America, Inc.; Tolerance: ±2%; Temperature Coefficient: C0G, NP0; Supplier 1: Digi-Key; Manufacturer Part Number: CL10C220GB8NNNC; RoHS: RoHS Compliant; Category: Capacitors; Stock 1: 20000; Pricing 1: 1=0.18, 10=0.128, 25=0.096, 50=0.0736, 100=0.0609, 500=0.04288, 1000=0.03519 (CAD); Packaging: Cut Tape (CT); Voltage - Rated: 50V; Mounting Type: Surface Mount, MLCC; Operating Temperature: -55°C ~ 125°C; Applications: General Purpose; Ratings: -; Package / Case: 0603 (1608 Metric); Size / Dimension: 0.063" L x 0.031" W (1.60mm x 0.80mm); Height - Seated (Max): -; Thickness (Max): 0.035" (0.90mm); Lead Spacing: -; Features: -; Lead Style: -; ComponentLink1URL: http://www.samsungsem.com/kr/support/product-search/mlcc/CL10C220GB8NNNC.jsp; ComponentLink1Description: http://www.samsungsem.com/kr/support/product-search/mlcc/CL10C220GB8NNNC.jsp; Supplier Part Number 1: 1276-2225-1-ND
C28 = GRM188R71H103KA01D: as C14 on sheet IMU; Supplier 1: Digi-Key; Manufacturer Part Number: GRM188R71H103KA01D; RoHS: RoHS Compliant; Category: Capacitors; Stock 1: 3064909; Pricing 1: 1=0.14, 10=0.027, 50=0.0142, 100=0.0121, 250=0.00988, 500=0.00848, 1000=0.00661 (CAD); Packaging: Cut Tape (CT); Voltage - Rated: 50V; Temperature Coefficient: X7R; Mounting Type: Surface Mount, MLCC; Operating Temperature: -55°C ~ 125°C; Applications: General Purpose; Ratings: -; Package / Case: 0603 (1608 Metric); Size / Dimension: 0.063" L x 0.031" W (1.60mm x 0.80mm); Height - Seated (Max): -; Thickness (Max): 0.035" (0.90mm); Lead Spacing: -; Features: -; Lead Style: -; ComponentLink1URL: http://www.murata.com/~/media/webrenewal/support/library/catalog/products/capacitor/mlcc/c02e.pdf; ComponentLink1Description: http://www.murata.com/~/media/webrenewal/support/library/catalog/products/capacitor/mlcc/c02e.pdf; Supplier Part Number 1: 490-1512-1-ND
C29 = CL10B333KB8SFNC: CAP CER 0.033UF 50V X7R 0603; Manufacturer: Samsung Electro-Mechanics America, Inc.; Tolerance: ±10%; Supplier 1: Digi-Key; Manufacturer Part Number: CL10B333KB8SFNC; RoHS: RoHS Compliant; Category: Capacitors; Stock 1: 125586; Pricing 1: 1=0.14, 10=0.036, 25=0.0256, 50=0.0194, 100=0.0158, 250=0.01324, 500=0.01128, 1000=0.00887 (CAD); Packaging: Cut Tape (CT); Voltage - Rated: 50V; Temperature Coefficient: X7R; Mounting Type: Surface Mount, MLCC; Operating Temperature: -55°C ~ 125°C; Applications: Boardflex Sensitive; Ratings: -; Package / Case: 0603 (1608 Metric); Size / Dimension: 0.063" L x 0.031" W (1.60mm x 0.80mm); Height - Seated (Max): -; Thickness (Max): 0.035" (0.90mm); Lead Spacing: -; Features: Soft Termination; Lead Style: -; ComponentLink1URL: http://www.samsungsem.com/kr/support/product-search/mlcc/CL10B333KB8SFNC.jsp; ComponentLink1Description: http://www.samsungsem.com/kr/support/product-search/mlcc/CL10B333KB8SFNC.jsp; Supplier Part Number 1: 1276-2042-1-ND
C31 = CL10B102KB8NNNC: CAP CER 1000PF 50V X7R 0603; Manufacturer: Samsung Electro-Mechanics America, Inc.; Tolerance: ±10%; Supplier 1: Digi-Key; Manufacturer Part Number: CL10B102KB8NNNC; RoHS: RoHS Compliant; Category: Capacitors; Stock 1: 295372; Pricing 1: 1=0.14, 10=0.024, 25=0.0172, 50=0.013, 100=0.0109, 500=0.00768, 1000=0.00597 (CAD); Packaging: Cut Tape (CT); Voltage - Rated: 50V; Temperature Coefficient: X7R; Mounting Type: Surface Mount, MLCC; Operating Temperature: -55°C ~ 125°C; Applications: General Purpose; Ratings: -; Package / Case: 0603 (1608 Metric); Size / Dimension: 0.063" L x 0.031" W (1.60mm x 0.80mm); Height - Seated (Max): -; Thickness (Max): 0.035" (0.90mm); Lead Spacing: -; Features: -; Lead Style: -; ComponentLink1URL: http://www.samsungsem.com/kr/support/product-search/mlcc/CL10B102KB8NNNC.jsp; ComponentLink1Description: http://www.samsungsem.com/kr/support/product-search/mlcc/CL10B102KB8NNNC.jsp; Supplier Part Number 1: 1276-1018-1-ND
C32 = GRM1555C1E4R7BA01D: CAP CER 4.7PF 25V NP0 0402; Manufacturer: Murata Electronics North America; Temperature Coefficient: C0G, NP0; Supplier 1: Digi-Key; Supplier Part Number 1: 490-8178-1-ND; Manufacturer Part Number: GRM1555C1E4R7BA01D; RoHS: RoHS Compliant; Category: Capacitors; Stock 1: 59490; Pricing 1: 1=0.14, 10=0.061, 50=0.033, 100=0.028, 250=0.02288, 500=0.01958, 1000=0.01526, 5000=0.01271 (CAD); Packaging: Cut Tape (CT); Part Status: Active; Voltage - Rated: 25V; Operating Temperature: -55°C ~ 125°C; Features: -; Ratings: -; Applications: General Purpose; Failure Rate: *; Mounting Type: Surface Mount, MLCC; Package / Case: 0402 (1005 Metric); Size / Dimension: 0.039" L x 0.020" W (1.00mm x 0.50mm); Height - Seated (Max): -; Thickness (Max): 0.022" (0.55mm); Lead Spacing: -; Lead Style: -; ComponentLink1URL: http://www.murata.com/~/media/webrenewal/support/library/catalog/products/capacitor/mlcc/c02e.pdf; ComponentLink1Description: http://www.murata.com/~/media/webrenewal/support/library/catalog/products/capacitor/mlcc/c02e.pdf
C33 = GRM155R61A222KA01D: CAP CER 2200PF 10V X5R 0402; Manufacturer: Murata Electronics North America; Supplier 1: Digi-Key; Supplier Part Number 1: 490-8251-1-ND; Manufacturer Part Number: GRM155R61A222KA01D; RoHS: RoHS Compliant; Category: Capacitors; Stock 1: 39963; Pricing 1: 1=0.14, 10=0.032, 50=0.0176, 100=0.0148, 250=0.01208, 500=0.01034, 1000=0.00805, 5000=0.00671 (CAD); Packaging: Cut Tape (CT); Part Status: Active; Voltage - Rated: 10V; Temperature Coefficient: X5R; Operating Temperature: -55°C ~ 85°C; Features: -; Ratings: -; Applications: General Purpose; Failure Rate: *; Mounting Type: Surface Mount, MLCC; Package / Case: 0402 (1005 Metric); Size / Dimension: 0.039" L x 0.020" W (1.00mm x 0.50mm); Height - Seated (Max): -; Thickness (Max): 0.022" (0.55mm); Lead Spacing: -; Lead Style: -; ComponentLink1URL: http://www.murata.com/~/media/webrenewal/support/library/catalog/products/capacitor/mlcc/c02e.pdf; ComponentLink1Description: http://www.murata.com/~/media/webrenewal/support/library/catalog/products/capacitor/mlcc/c02e.pdf
E1 = ANT-2.45-CHP-T: ANT 2.4GHZ 802.11 BLUETOOTH SMD; Manufacturer: Linx Technologies Inc.; Frequency Group: UHF (2 GHz ~ 3 GHz); Frequency Range: 2.36GHz ~ 2.54GHz; Antenna Type: Chip; Number of Bands: 1; VSWR: 2; Gain: 0.5dBi; Power - Max: 3W; Supplier 1: Digi-Key; Manufacturer Part Number: ANT-2.45-CHP-T; RoHS: RoHS Compliant; Category: RF/IF and RFID; Stock 1: 30000; Pricing 1: 1=4.78, 10=4.317, 25=3.8676, 100=3.4774, 250=3.08772, 500=2.69802 (CAD); Packaging: Cut Tape (CT); Frequency (Center/Band): 2.4GHz; Return Loss: -; Features: -; Termination: Solder; Ingress Protection: -; Mounting Type: Surface Mount; Height (Max): 0.002" (0.04mm); Applications: Bluetooth, WLAN, Zigbee™; ComponentLink1URL: http://www.linxtechnologies.com/resources/data-guides/ant-xxx-chp-x.pdf; ComponentLink1Description: http://www.linxtechnologies.com/resources/data-guides/ant-xxx-chp-x.pdf
L3 = LQP15MN3N9B02D: FIXED IND 3.9NH 170MA 500 MOHM; Manufacturer: Murata Electronics North America; Type: Thin Film; Material - Core: Non-Magnetic; Tolerance: ±0.1nH; Shielding: Unshielded; DC Resistance (DCR): 500 mOhm Max; Q @ Freq: 13 @ 500MHz; Frequency - Self Resonant: 6GHz; Frequency - Test: 500MHz; Supplier 1: Digi-Key; Supplier Part Number 1: 490-1131-1-ND; Manufacturer Part Number: LQP15MN3N9B02D; RoHS: RoHS Compliant; Category: Inductors, Coils, Chokes; Stock 1: 40315; Pricing 1: 1=0.25, 10=0.236, 25=0.2124, 50=0.184, 100=0.1651, 250=0.15336, 500=0.14154, 750=0.13445, 1000=0.12266 (CAD); Packaging: Cut Tape (CT); Part Status: Active; Current Rating: 170mA; Current - Saturation: -; Ratings: -; Operating Temperature: -40°C ~ 85°C; Mounting Type: Surface Mount; Package / Case: 0402 (1005 Metric); Size / Dimension: 0.039" L x 0.020" W (1.00mm x 0.50mm); Height - Seated (Max): 0.018" (0.45mm); ComponentLink1URL: http://search.murata.co.jp/Ceramy/image/img/PDF/ENG/L0075S0084LQP15M.pdf; ComponentLink1Description: http://search.murata.co.jp/Ceramy/image/img/PDF/ENG/L0075S0084LQP15M.pdf
R37 = RC0603FR-071ML: RES SMD 1M OHM 1% 1/10W 0603; Manufacturer: Yageo; Power (Watts): 0.1W, 1/10W; Temperature Coefficient: ±100ppm/°C; Supplier 1: Digi-Key; Manufacturer Part Number: RC0603FR-071ML; RoHS: RoHS Compliant; Category: Resistors; Stock 1: 1571699; Pricing 1: 1=0.15, 10=0.021, 25=0.0152, 100=0.0086, 250=0.0066, 500=0.00526, 1000=0.00389, 2500=0.00337 (CAD); Packaging: Cut Tape (CT); Tolerance: ±1%; Composition: Thick Film; Features: Moisture Resistant; Operating Temperature: -55°C ~ 155°C; Package / Case: 0603 (1608 Metric); Supplier Device Package: 0603; Size / Dimension: 0.063" L x 0.031" W (1.60mm x 0.80mm); Height: 0.022" (0.55mm); Number of Terminations: 2; ComponentLink1URL: http://www.yageo.com/documents/recent/PYu-RC_Group_51_RoHS_L_04.pdf; ComponentLink1Description: http://www.yageo.com/documents/recent/PYu-RC_Group_51_RoHS_L_04.pdf; Supplier Part Number 1: 311-1.00MHRCT-ND
R38 = RC0603FR-0722KL: RES SMD 22K OHM 1% 1/10W 0603; Manufacturer: Yageo; Power (Watts): 0.1W, 1/10W; Temperature Coefficient: ±100ppm/°C; Supplier 1: Digi-Key; Manufacturer Part Number: RC0603FR-0722KL; RoHS: RoHS Compliant; Category: Resistors; Stock 1: 2610640; Pricing 1: 1=0.15, 10=0.021, 25=0.0152, 100=0.0086, 250=0.0066, 500=0.00526, 1000=0.00389, 2500=0.00337 (CAD); Packaging: Cut Tape (CT); Tolerance: ±1%; Composition: Thick Film; Features: Moisture Resistant; Operating Temperature: -55°C ~ 155°C; Package / Case: 0603 (1608 Metric); Supplier Device Package: 0603; Size / Dimension: 0.063" L x 0.031" W (1.60mm x 0.80mm); Height: 0.022" (0.55mm); Number of Terminations: 2; ComponentLink1URL: http://www.yageo.com/documents/recent/PYu-RC_Group_51_RoHS_L_04.pdf; ComponentLink1Description: http://www.yageo.com/documents/recent/PYu-RC_Group_51_RoHS_L_04.pdf; Supplier Part Number 1: 311-22.0KHRCT-ND
U13 = NRF24L01P-R7: IC RF TXRX ISM>1GHZ 20-VFQFN; Manufacturer: Nordic Semiconductor ASA; RF Family/Standard: General ISM > 1GHZ; Modulation: GFSK; Frequency: 2.4GHz; Data Rate (Max): 2Mbps; Power - Output: 0dBm; Sensitivity: -94dBm; Serial Interfaces: SPI; Voltage - Supply: 1.9 V ~ 3.6 V; Current - Receiving: 12.6mA ~ 13.5mA; Current - Transmitting: 7mA ~ 11.3mA; Supplier 1: Digi-Key; Manufacturer Part Number: NRF24L01P-R7; RoHS: RoHS Compliant; Category: RF/IF and RFID; Stock 1: 9292; Pricing 1: 1=5.02, 10=4.479, 25=4.0312, 100=3.6725, 250=3.3142, 500=2.97384 (CAD); Packaging: Cut Tape (CT); Type: TxRx Only; Protocol: -; Memory Size: -; GPIO: -; Operating Temperature: -40°C ~ 85°C; Package / Case: 20-VFQFN Exposed Pad; ComponentLink1URL: http://www.nordicsemi.com/eng/content/download/2726/34069/file/nRF24L01P_Product_Specification_1_0.pdf; ComponentLink1Description: http://www.nordicsemi.com/eng/content/download/2726/34069/file/nRF24L01P_Product_Specification_1_0.pdf
X2 = 425F35B016M0000: CRYSTAL 16.0000MHZ 13PF SMD; Manufacturer: CTS-Frequency Controls; Frequency Stability: ±50ppm; Frequency Tolerance: ±30ppm; ESR (Equivalent Series Resistance): 100 Ohm; Operating Mode: Fundamental; Supplier 1: Digi-Key; Manufacturer Part Number: 425F35B016M0000; RoHS: RoHS Compliant; Category: Crystals and Oscillators; Stock 1: 2963; Pricing 1: 1=1.41, 10=1.246, 50=1.1634, 100=1.0295, 500=0.97292, 750=0.92144, 1000=0.81334 (CAD); Packaging: Cut Tape (CT); Type: MHz Crystal; Load Capacitance: 13pF; Operating Temperature: -20°C ~ 70°C; Ratings: -; Mounting Type: Surface Mount; Package / Case: 4-SMD, No Lead (DFN, LCC); Size / Dimension: 0.098" L x 0.079" W (2.50mm x 2.00mm); Height: 0.026" (0.65mm); ComponentLink1URL: http://www.ctscorp.com/wp-content/uploads/2015/11/008-0332-0_B.pdf; ComponentLink1Description: http://www.ctscorp.com/wp-content/uploads/2015/11/008-0332-0_B.pdf

## Sheet STM32.SchDoc: Microcontroleur
size A4; Organization: Robocup Ulaval; DocumentNumber: 2; Revision: 1.0; SheetNumber: 2; SheetTotal: 10; Version: Gamma 1.0; Conceptor: Philippe T. Simon B. Léonard G. Alexia B-L.
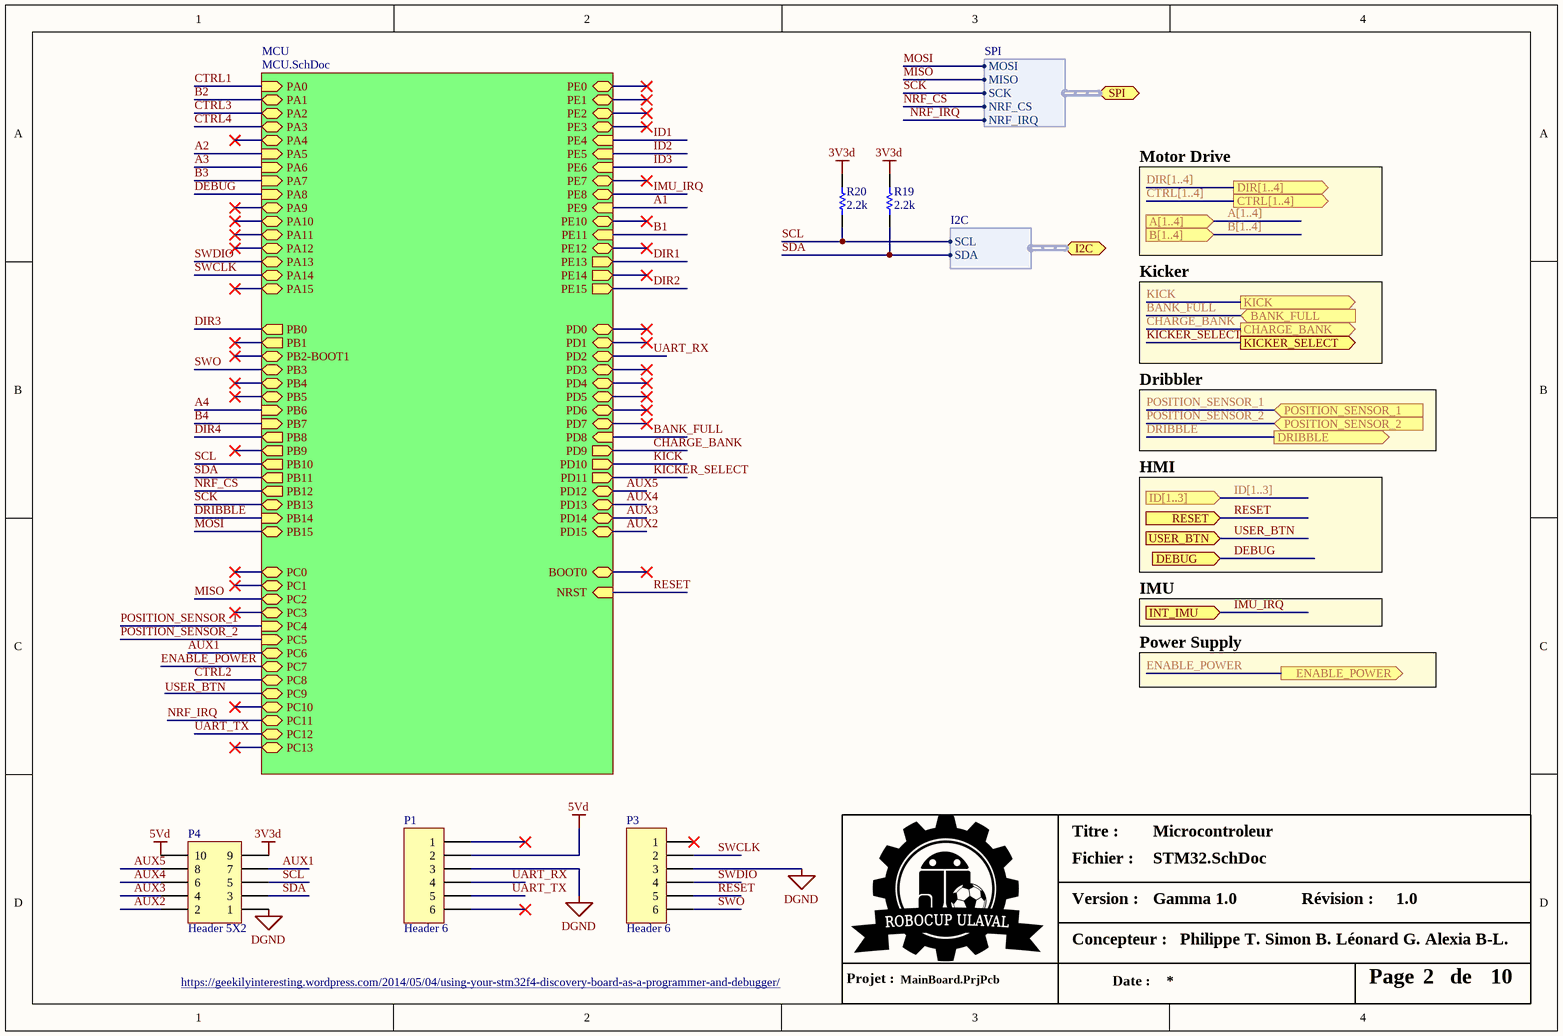
[diagram p8: STM32.SchDoc]

### Parts
P1  Header 6  [HDR1X6]
P3  Header 6  [HDR1X6]
P4  Header 5X2  [HDR2X5]
R19  Resistance (Ohms): 2.2k  [0603]  (hidden comment: RC0603FR-072K2L)
R20  Resistance (Ohms): 2.2k  [0603]  (hidden comment: RC0603FR-072K2L)

### Sub-sheets
MCU = MCU.SchDoc: PA0 (in), PA1, PA2, PA3, PA4, PA5 (in), PA6 (in), PA7 (in), PA8 (in), PA9, PA10, PA11, PA12, PA13, PA14, PA15, PB0 (out), PB1 (out), PB2-BOOT1, PB3, PB4, PB5, PB6 (in), PB7 (in), PB8 (out), PB9 (out), PB10 (out), PB11 (out), PB12 (out), PB13 (bidir), PB14 (in), PB15 (bidir), PC0, PC1, PC2 (bidir), PC3, PC4 (in), PC5 (in), PC6, PC7, PC8, PC9 (bidir), PC10, PC11, PC12, PC13, PE15 (out), PE14 (out), PE13 (out), PE12, PE11 (in), PE10, PE9 (in), PE8, PE7, PE6 (in), PE5 (in), PE4 (in), PE3, PE2, PE1, PE0, PD15, PD14, PD13, PD12, PD11 (out), PD10 (out), PD9 (out), PD8 (in), PD7, PD6, PD5, PD4, PD3, PD2, PD1, PD0, BOOT0, NRST (in)

### Ports
A[1..4] (in), B[1..4] (in), BANK_FULL (in), CHARGE_BANK (out), CTRL[1..4] (out), DEBUG (in), DIR[1..4] (out), DRIBBLE (out), ENABLE_POWER (out), I2C (harness I2C), ID[1..3] (in), INT_IMU (in), KICK (out), KICKER_SELECT (out), POSITION_SENSOR_1 (in), POSITION_SENSOR_2 (in), RESET (in), SPI (harness SPI), USER_BTN (in)

### Harnesses
I2C: SCL, SDA
SPI: MOSI, MISO, SCK, NRF_CS, NRF_IRQ

### Nets
3V3d: P4.9 R19.2 R20.2
5Vd: P1.2 P4.10
DGND: P1.3 P3.3 P4.1
AUX1: P4.7 ; sheet MCU/PC6
AUX2: P4.2 ; sheet MCU/PD15
AUX3: P4.4 ; sheet MCU/PD14
AUX4: P4.6 ; sheet MCU/PD13
AUX5: P4.8 ; sheet MCU/PD12
BANK_FULL: port BANK_FULL, sheet MCU/PD8
CHARGE_BANK: port CHARGE_BANK, sheet MCU/PD9
DEBUG: port DEBUG, sheet MCU/PA8
DRIBBLE: port DRIBBLE, sheet MCU/PB14
ENABLE_POWER: port ENABLE_POWER, sheet MCU/PC7
IMU_IRQ: port INT_IMU, sheet MCU/PE8
KICK: port KICK, sheet MCU/PD10
KICKER_SELECT: port KICKER_SELECT, sheet MCU/PD11
MISO: sheet MCU/PC2, port SPI.MISO
MOSI: sheet MCU/PB15, port SPI.MOSI
NRF_CS: sheet MCU/PB12, port SPI.NRF_CS
NRF_IRQ: sheet MCU/PC11, port SPI.NRF_IRQ
POSITION_SENSOR_1: port POSITION_SENSOR_1, sheet MCU/PC4
POSITION_SENSOR_2: port POSITION_SENSOR_2, sheet MCU/PC5
RESET: P3.5 ; port RESET, sheet MCU/NRST
SCK: sheet MCU/PB13, port SPI.SCK
SCL: P4.5 R20.1 ; sheet MCU/PB10, port I2C.SCL
SDA: P4.3 R19.1 ; sheet MCU/PB11, port I2C.SDA
SWCLK: P3.2 ; sheet MCU/PA14
SWDIO: P3.4 ; sheet MCU/PA13
SWO: P3.6 ; sheet MCU/PB3
UART_RX: P1.4 ; sheet MCU/PD2
UART_TX: P1.5 ; sheet MCU/PC12

Not connected (* = marked no-connect by the designer): P1 1* 6*; P3 1*

### Buses and harness runs
bus A[1..4] = port A[1..4]
bus B[1..4] = port B[1..4]
bus CTRL[1..4] = port CTRL[1..4]
bus DIR[1..4] = port DIR[1..4]
bus ID[1..3] = port ID[1..3]

### Notes on the sheet
- Motor Drive
- Kicker
- Dribbler
- HMI
- Power Supply
- IMU
- Titre :
- Version :
- Fichier :
- Révision :
- https://geekilyinteresting.wordpress.com/2014/05/04/using-your-stm32f4-discovery-board-as-a-programmer-and-debugger/
- Projet :
- Concepteur :
- Date :
- Page
- de
- Labels drawn without touching a wire or pin: USER_BTN

### Library data of the parts
P1 P3 = Header 6: Header, 6-Pin; LatestRevisionDate: 17-Jul-2002; LatestRevisionNote: Re-released for DXP Platform.; Publisher: Altium Limited
P4 = Header 5X2: Header, 5-Pin, Dual row; LatestRevisionDate: 17-Jul-2002; LatestRevisionNote: Re-released for DXP Platform.; Publisher: Altium Limited
R19 R20 = RC0603FR-072K2L: as R21 on sheet HMI; Supplier 1: Digi-Key; Manufacturer Part Number: RC0603FR-072K2L; RoHS: RoHS Compliant; Category: Resistors; Stock 1: 297758; Pricing 1: 1=0.15, 10=0.021, 25=0.0152, 100=0.0086, 250=0.0066, 500=0.00526, 1000=0.00389, 2500=0.00337 (CAD); Packaging: Cut Tape (CT); Tolerance: ±1%; Composition: Thick Film; Features: Moisture Resistant; Operating Temperature: -55°C ~ 155°C; Package / Case: 0603 (1608 Metric); Supplier Device Package: 0603; Size / Dimension: 0.063" L x 0.031" W (1.60mm x 0.80mm); Height: 0.022" (0.55mm); Number of Terminations: 2; ComponentLink1URL: http://www.yageo.com/documents/recent/PYu-RC_Group_51_RoHS_L_04.pdf; ComponentLink1Description: http://www.yageo.com/documents/recent/PYu-RC_Group_51_RoHS_L_04.pdf; Supplier Part Number 1: 311-2.20KHRCT-ND